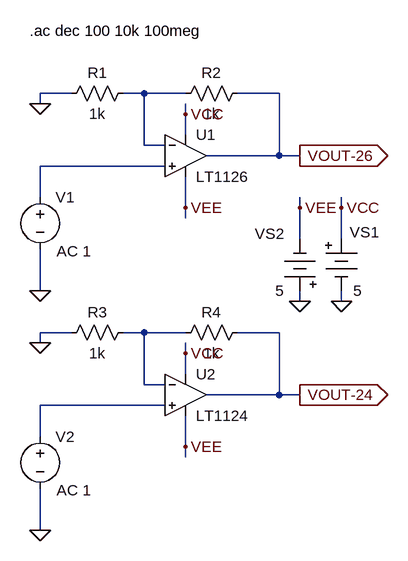
[diagram p0: schematic fig-03-01-35.asc]
fig-03-01-35.asc, the LTspice schematic file:
Version 4
SHEET 1 1172 772
WIRE 96 80 48 80
WIRE 208 80 176 80
WIRE 272 80 208 80
WIRE 416 80 352 80
WIRE 48 96 48 80
WIRE 272 112 272 96
WIRE 272 144 272 112
WIRE 208 160 208 80
WIRE 240 160 208 160
WIRE 416 176 416 80
WIRE 416 176 304 176
WIRE 448 176 416 176
WIRE 240 192 48 192
WIRE 48 240 48 192
WIRE 272 256 272 208
WIRE 448 256 448 240
WIRE 512 256 512 240
WIRE 272 272 272 256
WIRE 448 304 448 256
WIRE 512 304 512 256
WIRE 48 384 48 320
WIRE 448 400 448 384
WIRE 512 400 512 384
WIRE 96 448 48 448
WIRE 208 448 176 448
WIRE 272 448 208 448
WIRE 416 448 352 448
WIRE 48 464 48 448
WIRE 272 480 272 464
WIRE 272 512 272 480
WIRE 208 528 208 448
WIRE 240 528 208 528
WIRE 416 544 416 448
WIRE 416 544 304 544
WIRE 448 544 416 544
WIRE 240 560 48 560
WIRE 48 608 48 560
WIRE 272 624 272 576
WIRE 272 640 272 624
WIRE 48 752 48 688
FLAG 48 384 0
FLAG 448 176 VOUT-26
IOPIN 448 176 Out
FLAG 448 400 0
FLAG 512 400 0
FLAG 448 256 VEE
FLAG 512 256 VCC
FLAG 48 96 0
FLAG 272 112 VCC
FLAG 272 256 VEE
FLAG 48 752 0
FLAG 448 544 VOUT-24
IOPIN 448 544 Out
FLAG 48 464 0
FLAG 272 480 VCC
FLAG 272 624 VEE
SYMBOL Misc\\battery 512 288 R0
WINDOW 0 13 6 Left 2
WINDOW 3 18 96 Left 2
WINDOW 123 0 0 Left 0
WINDOW 39 0 0 Left 0
SYMATTR InstName VS1
SYMATTR Value 5
SYMBOL Misc\\battery 448 400 R180
WINDOW 0 24 104 Left 2
WINDOW 3 24 16 Left 2
WINDOW 123 0 0 Left 0
WINDOW 39 0 0 Left 0
SYMATTR InstName VS2
SYMATTR Value 5
SYMBOL voltage 48 224 R0
WINDOW 3 -107 200 Left 2
WINDOW 123 25 99 Left 2
WINDOW 39 0 0 Left 0
SYMATTR Value ""
SYMATTR Value2 AC 1
SYMATTR InstName V1
SYMBOL res 368 64 R90
WINDOW 0 0 56 VBottom 2
WINDOW 3 32 56 VTop 2
SYMATTR InstName R2
SYMATTR Value 1k
SYMBOL res 192 64 R90
WINDOW 0 0 56 VBottom 2
WINDOW 3 32 56 VTop 2
SYMATTR InstName R1
SYMATTR Value 1k
SYMBOL Opamps\\LT1126 272 112 R0
SYMATTR InstName U1
SYMBOL voltage 48 592 R0
WINDOW 3 -107 200 Left 2
WINDOW 123 25 99 Left 2
WINDOW 39 0 0 Left 0
SYMATTR Value ""
SYMATTR Value2 AC 1
SYMATTR InstName V2
SYMBOL res 368 432 R90
WINDOW 0 0 56 VBottom 2
WINDOW 3 32 56 VTop 2
SYMATTR InstName R4
SYMATTR Value 1k
SYMBOL res 192 432 R90
WINDOW 0 0 56 VBottom 2
WINDOW 3 32 56 VTop 2
SYMATTR InstName R3
SYMATTR Value 1k
SYMBOL Opamps\\LT1124 272 480 R0
SYMATTR InstName U2
TEXT 32 -16 Left 2 !.ac dec 100 10k 100meg

The netlist it stands for:
* fig-03-01-35.asc
VS1 VCC 0 5
VS2 0 VEE 5
V1 N002 0 AC 1
R2 VOUT-26 N001 1k
R1 N001 0 1k
XU1 N002 N001 VCC VEE VOUT-26 LT1126  ; pins In+ In- V+ V- OUT
V2 N004 0 AC 1
R4 VOUT-24 N003 1k
R3 N003 0 1k
XU2 N004 N003 VCC VEE VOUT-24 LT1124  ; pins In+ In- V+ V- OUT
.ac dec 100 10k 100meg
.lib LTC.lib
.backanno
.end